# Altium project bigpine.PrjPCB (part 2 of 2)
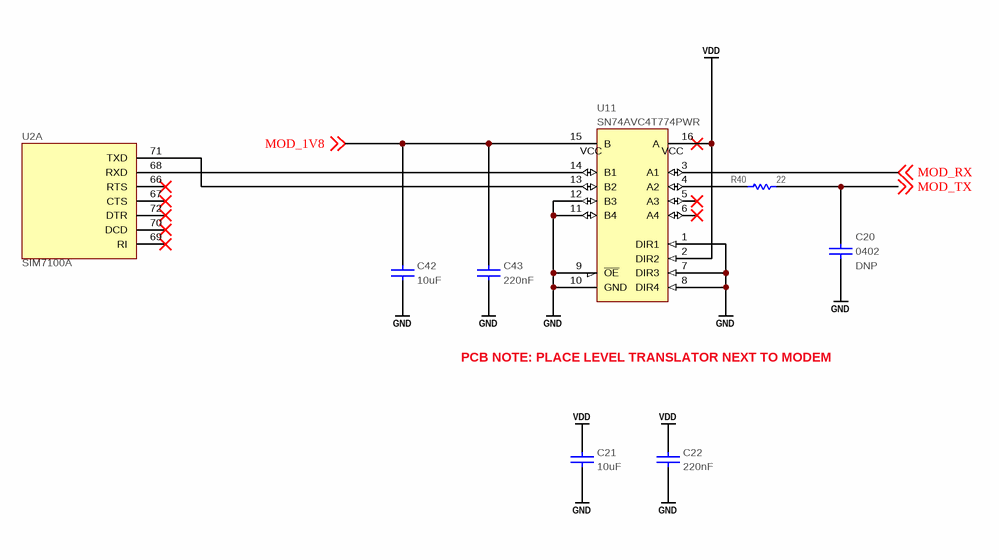
[diagram p14: 09-modem3.SchDoc]

## Nets that join several sheets
GND: 02-mcu0 (22 pins), 03-mcu1 (C9.1 C10.1), 04-mcu2 (C11.1 C12.1), 05-mcu3 (R15.1 R16.1 R17.1), 14-misc (59 pins), 13-connectors (24 pins), 06-modem0 (26 pins), 10-power (40 pins), 11-mppt (13 pins), 12-sdcard (8 pins), 07-modem1 (10 pins), 08-modem2 (P8.2 P9.2 P10.2), 09-modem3 (12 pins)
VBAT: 14-misc (D1.1 D2.1 F6.1), 06-modem0 (D3.1 D4.1), 10-power (13 pins), 11-mppt (7 pins)
VCAP: 02-mcu0 (U1.6), 14-misc (F3.1), 13-connectors (P1.2), 10-power (C36.1 D11.2 R46.2 R47.2)
VCORE: 02-mcu0 (6 pins), 14-misc (F2.1), 10-power (6 pins)
VDD: 02-mcu0 (23 pins), 03-mcu1 (R1.2), 05-mcu3 (R10.2 R11.2 R12.2 R13.2), 14-misc (18 pins), 13-connectors (14 pins), 06-modem0 (U10.1 U10.3 U10.4), 10-power (8 pins), 12-sdcard (9 pins), 09-modem3 (C21.1 C22.1 U11.2 U11.16)
VMOT: 14-misc (F4.1), 13-connectors (P1.20 P1.21 P1.22 P3.3), 10-power (6 pins)
BUZZ: 03-mcu1 (U1.55), 14-misc (Q7.1 R66.1)
CAM1_CS: 05-mcu3 (U1.173), 13-connectors (P2.1)
CAM1_EN: 03-mcu1 (U1.56), 13-connectors (U4.2)
CAM1_MISO: 05-mcu3 (U1.133), 13-connectors (P2.3)
CAM1_MOSI: 05-mcu3 (U1.134), 13-connectors (P2.2)
CAM1_SCL: 03-mcu1 (U1.167), 13-connectors (P2.10 R19.1)
CAM1_SCLK: 05-mcu3 (R14.1), 13-connectors (P2.4)
CAM1_SDA: 03-mcu1 (U1.168), 13-connectors (P2.9 R18.1)
CAM2_CS: 04-mcu2 (U1.2), 13-connectors (P2.15)
CAM2_EN: 03-mcu1 (U1.57), 13-connectors (U5.2)
CAM2_MISO: 04-mcu2 (U1.4), 13-connectors (P2.17)
CAM2_MOSI: 04-mcu2 (U1.5), 13-connectors (P2.16)
CAM2_SCL: 04-mcu2 (U1.17), 13-connectors (P2.24 R21.1)
CAM2_SCLK: 04-mcu2 (R6.1), 13-connectors (P2.18)
CAM2_SDA: 04-mcu2 (U1.16), 13-connectors (P2.23 R20.1)
I2C3_SCL: 04-mcu2 (U1.84), 14-misc (P6.19 R31.1)
I2C3_SDA: 04-mcu2 (U1.85), 14-misc (P6.21 R32.1)
IMU_CS1: 03-mcu1 (U1.53), 13-connectors (P1.3)
IMU_CS2: 03-mcu1 (U1.119), 13-connectors (P1.4)
IMU_CS3: 03-mcu1 (U1.120), 13-connectors (P1.5)
IMU_INT_ACCEL: 03-mcu1 (U1.121), 13-connectors (P1.9)
IMU_INT_GYRO: 03-mcu1 (U1.122), 13-connectors (P1.10)
IMU_MISO: 03-mcu1 (U1.52), 13-connectors (P1.6)
IMU_MOSI: 03-mcu1 (U1.151), 13-connectors (P1.7)
IMU_SCK: 04-mcu2 (R7.2), 13-connectors (P1.8)
INT_RSTN: 03-mcu1 (R1.1 U1.40), 14-misc (S2.1 S2.4), 10-power (U14.4)
JTCK-SWCLK: 03-mcu1 (U1.137), 14-misc (C16.2 P4.9 R28.2 U8.4)
JTDI: 03-mcu1 (U1.138), 14-misc (P4.5 R23.1 U8.3)
JTDO-TRACESWO: 03-mcu1 (U1.161), 14-misc (P4.13 R25.1 U9.6)
JTMS-SWDIO: 03-mcu1 (U1.124), 14-misc (P4.7 R24.1 U8.6)
LED1: 03-mcu1 (U1.54), 14-misc (Q4.5 R67.2)
LED2: 03-mcu1 (U1.35), 14-misc (Q4.2 R68.2)
LIDAR_EN: 03-mcu1 (U1.58), 13-connectors (U6.2)
LIDAR_RX: 03-mcu1 (R4.2), 13-connectors (P2.13 U7.4)
LIDAR_TX: 03-mcu1 (U1.80), 13-connectors (P2.12 U7.6)
MOD_1V8: 06-modem0 (U2.15), 09-modem3 (C42.1 C43.1 U11.15)
MOD_EN: 03-mcu1 (U1.93), 06-modem0 (U10.2)
MOD_PWR: 05-mcu3 (U1.7), 06-modem0 (Q3.2)
MOD_RST: 05-mcu3 (U1.11), 06-modem0 (Q3.5)
MOD_RX: 03-mcu1 (R2.2), 09-modem3 (U11.3)
MOD_TX: 03-mcu1 (U1.47), 09-modem3 (C20.1 R40.1)
MOT1_DATA: 03-mcu1 (U1.123), 13-connectors (P1.23 U7.1)
MOT2_DATA: 03-mcu1 (U1.164), 13-connectors (P3.2 U7.3)
NET_LED_EN: 04-mcu2 (U1.64), 06-modem0 (Q1.2)
NJTRST: 03-mcu1 (U1.162), 14-misc (P4.3 R22.1 U8.1)
RSTN: 05-mcu3 (R13.1 U1.31), 14-misc (P4.15 S1.1 S1.4 U9.4)
SD_EN: 03-mcu1 (U1.115), 12-sdcard (U15.2)
SDCD: 03-mcu1 (U1.116), 12-sdcard (J1.10 R63.1)
SDCLK: 03-mcu1 (R3.1), 12-sdcard (J1.5)
SDCMD: 03-mcu1 (U1.144), 12-sdcard (J1.3 R58.1)
SDDAT0: 03-mcu1 (U1.117), 12-sdcard (J1.7 R59.1)
SDDAT1: 03-mcu1 (U1.118), 12-sdcard (J1.8 R60.1)
SDDAT2: 03-mcu1 (U1.139), 12-sdcard (J1.1 R61.1)
SDDAT3: 03-mcu1 (U1.140), 12-sdcard (J1.2 R62.1)
SPI5_MISO: 04-mcu2 (U1.26), 14-misc (P6.5)
SPI5_MOSI: 04-mcu2 (U1.27), 14-misc (P6.7)
SPI5_NSS: 04-mcu2 (U1.24), 14-misc (P6.1)
SPI5_SCK: 04-mcu2 (R9.1), 14-misc (P6.3)
STAT_LED_EN: 04-mcu2 (U1.65), 06-modem0 (Q2.2)
USART1_RX: 03-mcu1 (U1.95), 14-misc (P4.19 P5.4 R27.1 U9.3)
USART1_TX: 03-mcu1 (R5.2), 14-misc (P4.17 P5.5 R26.1 U9.1)
USART6_RX: 04-mcu2 (U1.152), 14-misc (P6.37 R33.1)
USART6_TX: 04-mcu2 (R8.2), 14-misc (P6.39 R34.1)
VCORE_TRIM: 03-mcu1 (U1.50), 10-power (R56.1)
VDD_EN: 03-mcu1 (U1.8), 10-power (Q6.2 R46.1)
VMOT_EN: 03-mcu1 (U1.163), 10-power (U13.13)
VMOT_TRIM: 03-mcu1 (U1.51), 10-power (R53.1)
WAKE: 14-misc (S3.1 S3.4), 10-power (Q6.5 R65.1)